# EAGLE design switch_v0.1 (EAGLE 7.7.0)

## Sheet 1 of 2
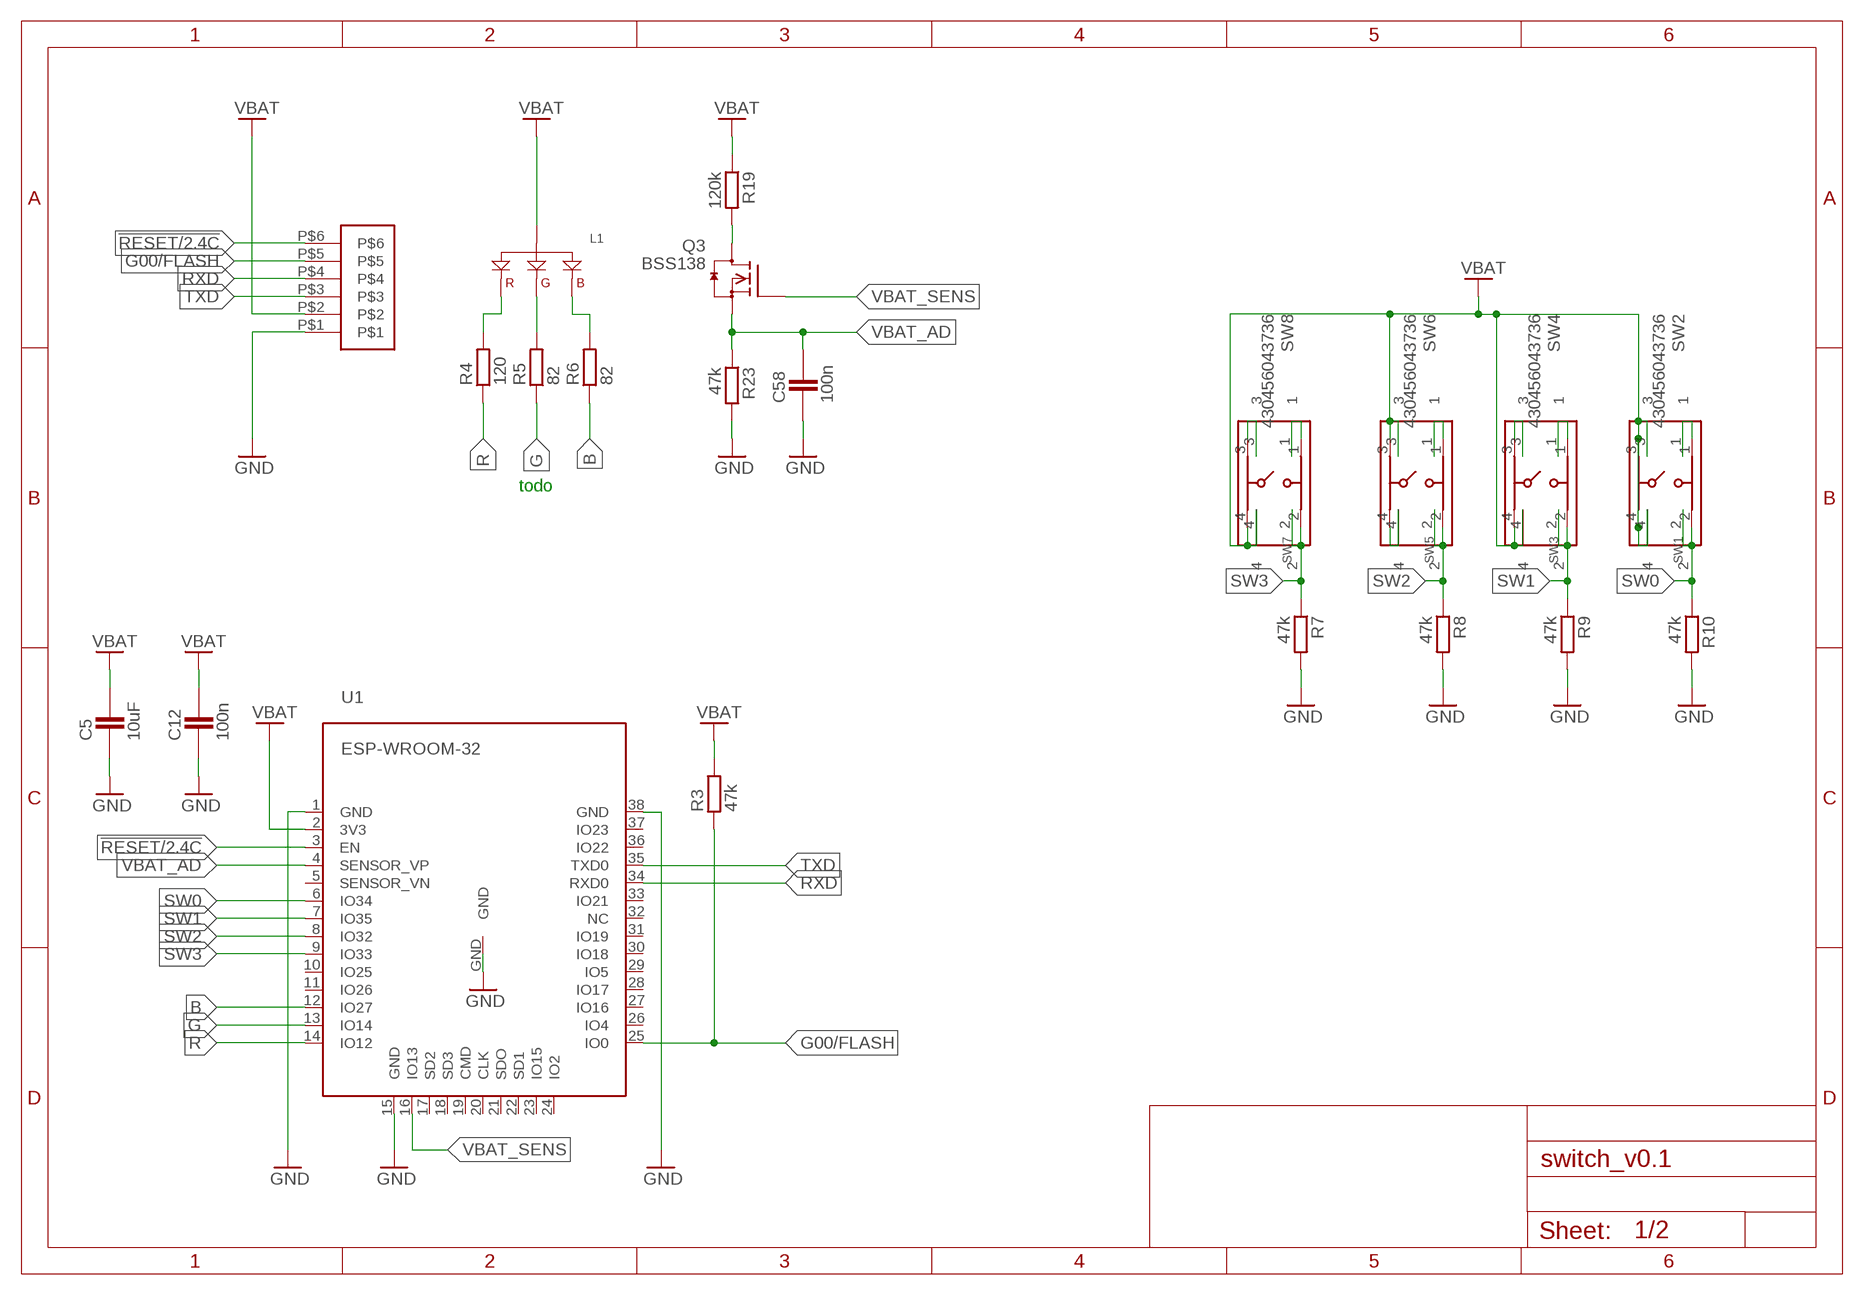
[diagram p0: schematic, sheet 1]

### Parts
C5  10uF  CAPACITOR_0805  [CAPC2012X145AN]
C12  100n  CAPACITOR_0402  [CAPC1005X60N]
C58  100n  CAPACITOR_0402  [CAPC1005X60N]
L1  RGBLED_COMMONA  [LEDRGB]
Q3  BSS138  [SOT23]
R3  47k  RESISTOR_0402  [RESC1005X40AN]
R4  120  RESISTOR_0805  [RESC2012X70N]
R5  82  RESISTOR_0805  [RESC2012X70N]
R6  82  RESISTOR_0805  [RESC2012X70N]
R7  47k  RESISTOR_0402  [RESC1005X40AN]
R8  47k  RESISTOR_0402  [RESC1005X40AN]
R9  47k  RESISTOR_0402  [RESC1005X40AN]
R10  47k  RESISTOR_0402  [RESC1005X40AN]
R19  120k  RESISTOR_0402  [RESC1005X40AN]
R23  47k  RESISTOR_0402  [RESC1005X40AN]
SW1  4301X20858X6  [4301X20858X6]
SW2  430456043736  [430456043736]
SW3  4301X20858X6  [4301X20858X6]
SW4  430456043736  [430456043736]
SW5  4301X20858X6  [4301X20858X6]
SW6  430456043736  [430456043736]
SW7  4301X20858X6  [4301X20858X6]
SW8  430456043736  [430456043736]
U1  ESP-WROOM-32  [ESP-WROOM-32]
U$3  3X2-2.00RM  [3X2-2.00RM]

### Nets
!RESET: U1.3(EN) U$3.P$6 ; also sheet 2
B: R6.1 U1.12(IO27)
G: R5.1 U1.13(IO14)
G00/FLASH: R3.1 U1.25(IO0) U$3.P$5
GND: C5.1 C12.1 C58.1 R7.2 R8.2 R9.2 R10.2 R23.2 U1.1(GND) U1.15(GND) U1.38(GND) U1.GND U$3.P$1 ; also sheet 2
N$4: L1.1(R) R4.2
N$5: L1.3(G) R5.2
N$6: L1.4(B) R6.2
N$7: SW5.1 SW6.1
N$8: SW5.4 SW6.4
N$9: SW7.3 SW8.3
N$11: SW7.1 SW8.1
N$12: SW3.1 SW4.1
N$13: SW3.3 SW4.3
N$14: SW1.1 SW2.1
N$51: Q3.3(D) R19.2
R: R4.1 U1.14(IO12)
RXD: U1.34(RXD0) U$3.P$4
SW0: R10.1 SW1.2 SW2.2 U1.6(IO34)
SW1: R9.1 SW3.2 SW4.2 U1.7(IO35)
SW2: R8.1 SW5.2 SW6.2 U1.8(IO32)
SW3: R7.1 SW7.2 SW8.2 U1.9(IO33)
TXD: U1.35(TXD0) U$3.P$3
VBAT: C5.2 C12.2 L1.2(A) R3.2 R19.1 SW1.3 SW1.4 SW2.3 SW2.4 SW3.4 SW4.4 SW5.3 SW6.3 SW7.4 SW8.4 U1.2(3V3) U$3.P$2 ; also sheet 2
VBAT_AD: C58.2 Q3.2(S) R23.1 U1.4(SENSOR_VP)
VBAT_SENS: Q3.1(G) U1.16(IO13)
Unconnected: U1.5(SENSOR_VN) U1.10(IO25) U1.11(IO26) U1.17(SD2) U1.18(SD3) U1.19(CMD) U1.20(CLK) U1.21(SDO) U1.22(SD1) U1.23(IO15) U1.24(IO2) U1.26(IO4) U1.27(IO16) U1.28(IO17) U1.29(IO5) U1.30(IO18) U1.31(IO19) U1.32(NC) U1.33(IO21) U1.36(IO22) U1.37(IO23)

### Notes on the sheet
- todo

## Sheet 2 of 2
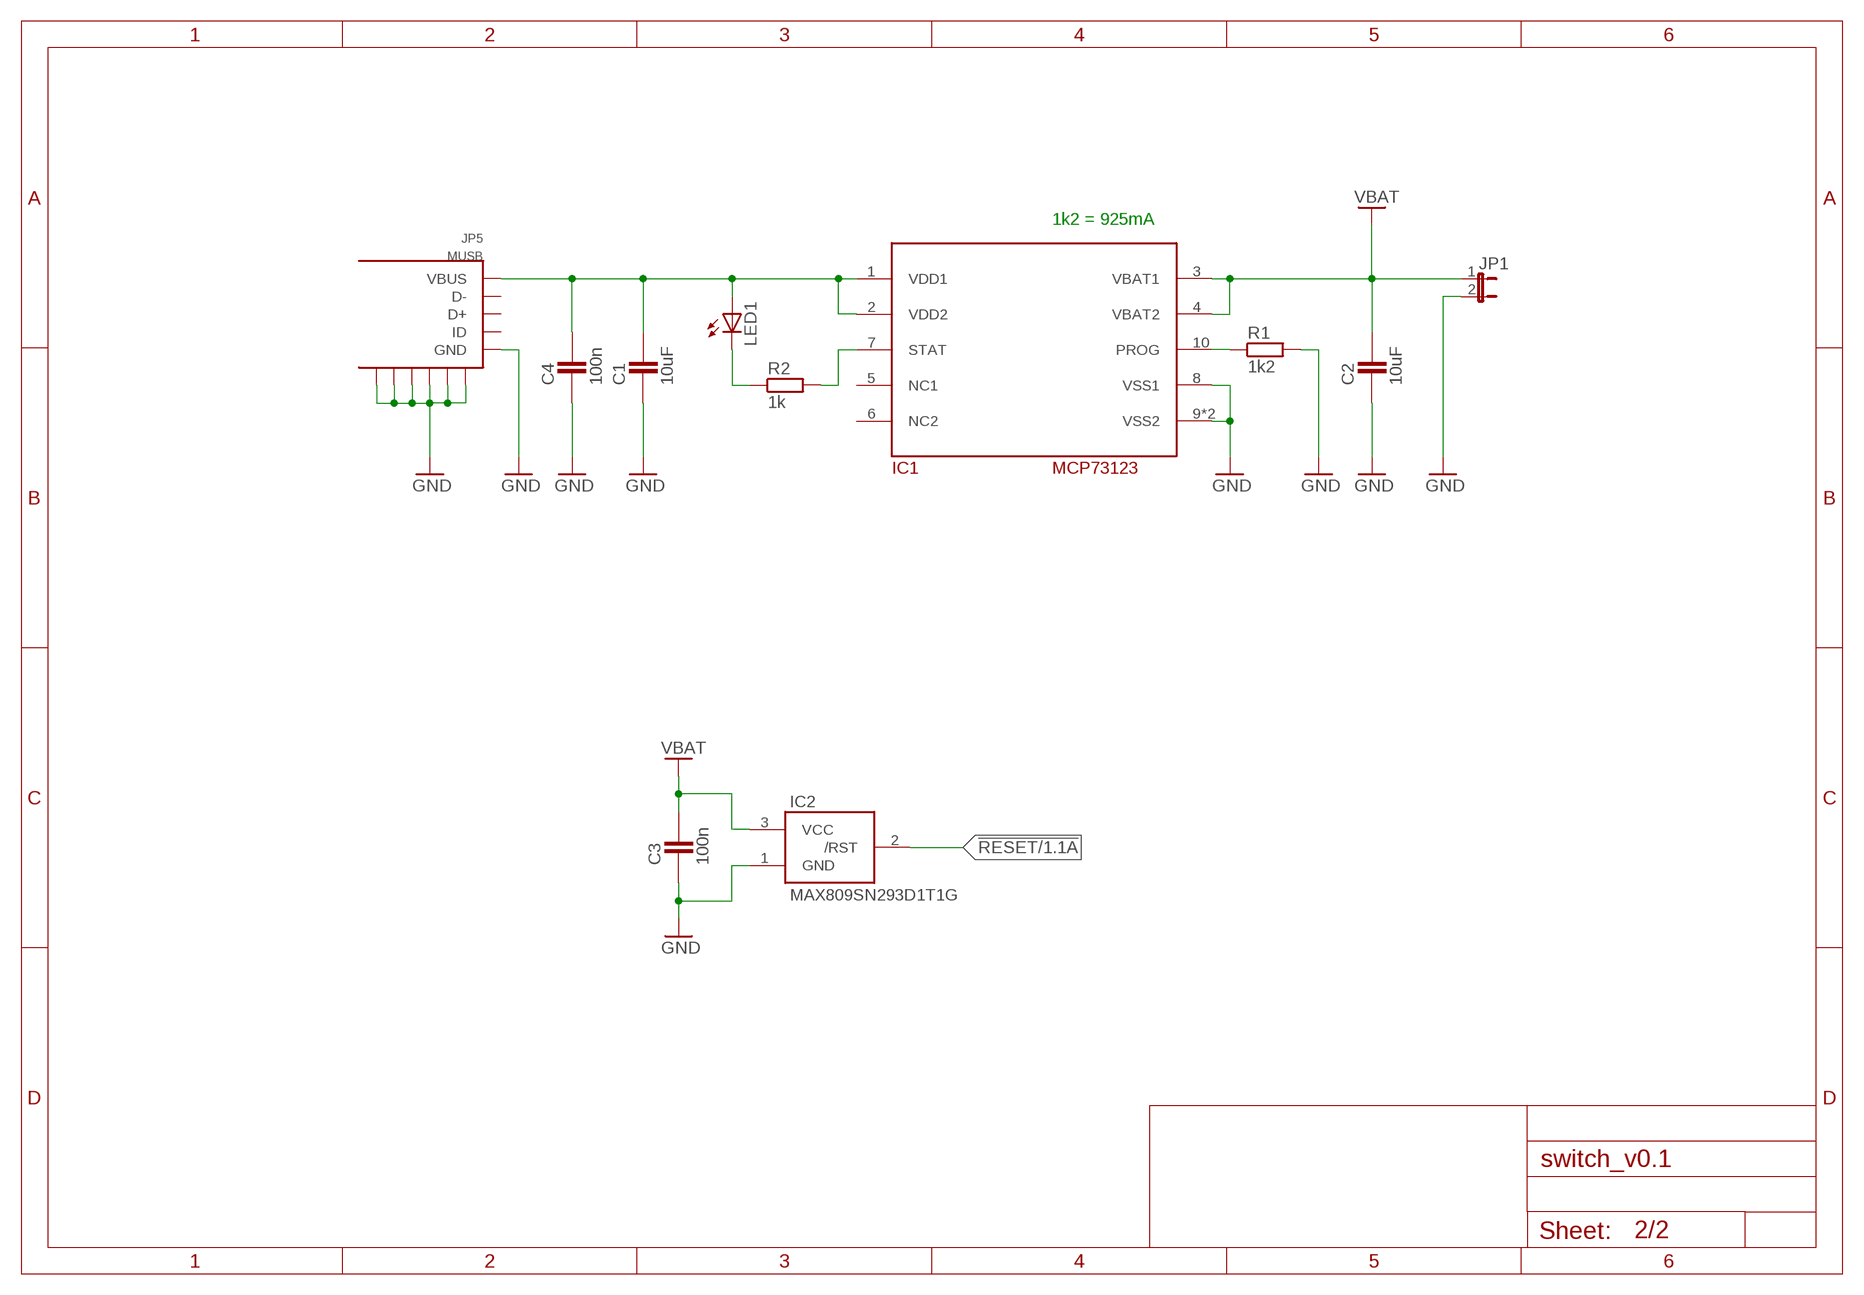
[diagram p1: schematic, sheet 2]

### Parts
C1  10uF  CAPACITOR_0805  [CAPC2012X145AN]
C2  10uF  CAPACITOR_0805  [CAPC2012X145AN]
C3  100n  CAPACITOR_0402  [CAPC1005X60N]
C4  100n  CAPACITOR_0402  [CAPC1005X60N]
IC1  MCP73123  [DFN10-3X3]
IC2  MAX809SN293D1T1G  MAX809JEUR  [SOT23]
JP1  JP1E  [JP1]
JP5  MUSB  [MICRO-USB]
LED1  LEDCHIPLED_0805  [CHIPLED_0805]
R1  1k2  RESISTOR_0402  [RESC1005X40AN]
R2  1k  RESISTOR_0402  [RESC1005X40AN]

### Nets
!RESET: IC2.2(/RST) ; also sheet 1
GND: C1.1 C2.1 C3.1 C4.1 IC1.8(VSS1) IC1.9(VSS2) IC1.EXP(VSS2) IC2.1(GND) JP1.2 JP5.G$1(S1) JP5.G$2(S2) JP5.G$3(S3) JP5.G$4(S4) JP5.P$5(GND) JP5.S$1(S5) JP5.S$2(S6) R1.2 ; also sheet 1
N$1: C1.2 C4.2 IC1.1(VDD1) IC1.2(VDD2) JP5.P$1(VBUS) LED1.A
N$2: LED1.C R2.1
N$3: IC1.7(STAT) R2.2
N$10: IC1.10(PROG) R1.1
VBAT: C2.2 C3.2 IC1.3(VBAT1) IC1.4(VBAT2) IC2.3(VCC) JP1.1 ; also sheet 1
Unconnected: IC1.5(NC1) IC1.6(NC2) JP5.P$2(D-) JP5.P$3(D+) JP5.P$4(ID)

### Notes on the sheet
- 1k2 = 925mA

## Library data of the parts
C1-C5 C12 C58 = ipc-7351-capacitor:CAPACITOR_
IC1 = LiFePO4wer:MCP73123: MCP73123 LiFePO4 battery charger
IC2 = maxim-10:MAX809*: 3-Pin Microprocessor Reset Circuit
JP1 = jumper:JP1E: JUMPER
JP5 = vario_spc:MUSB
L1 = sid:RGBLED_COMMONA
LED1 = led:LED: LED OSRAM: - CHIPLED LG R971, LG N971, LY N971, LG Q971, LY Q971, LO R971, LY R971 LH N974, LH R974 LS Q976, LO Q976, LY Q976 LO Q996 - Hyper CHIPLED LW Q18S LB Q993, LB Q99A, LB R99A - SideLED LS A670, LO A670, LY A670, LG A670, LP A670 LB A673, LV A673, LT A673, LW A673 LH A674 LY A675 LS A676, LA A676, LO A676, LY A676, LW A676 LS A679, LY A679, LG A679 - Hyper Micro SIDELED® LS Y876, LA Y876, LO Y876, LY Y876 LT Y87S - SmartLED LW L88C, LW L88S LB L89C, LB L89S, LG L890 LS L89K, LO L89K, LY L89K LS L896, LA L896, LO L896, LY L896 - TOPLED LS T670, LO T670, LY T670, LG T670, LP T670 LSG T670, LSP T670, LSY T670, LOP T670, LYG T670 LG T671, LOG T671, LSG T671 LB T673, LV T673, LT T673, LW T673 LH T674 LS T676, LA T676, LO T676, LY T676, LB T676, LH T676, LSB T676, LW T676 LB T67C, LV T67C, LT T67C, LS T67K, LO T67K, LY T67K, LW E67C LS E67B, LA E67B, LO E67B, LY E67B, LB E67C, LV E67C, LT E67C LW T67C LS T679, LY T679, LG T679 LS T770, LO T770, LY T770, LG T770, LP T770 LB T773, LV T773, LT T773, LW T773 LH T774 LS E675, LA E675, LY E675, LS T675 LS T776, LA T776, LO T776, LY T776, LB T776 LHGB T686 LT T68C, LB T68C - Hyper Mini TOPLED® LB M676 - Mini TOPLED Santana® LG M470 LS M47K, LO M47K, LY M47K Source: http://www.osram.convergy.de LUXEON: - LUMILED® LXK2-PW12-R00, LXK2-PW12-S00, LXK2-PW14-U00, LXK2-PW14-V00 LXK2-PM12-R00, LXK2-PM12-S00, LXK2-PM14-U00 LXK2-PE12-Q00, LXK2-PE12-R00, LXK2-PE12-S00, LXK2-PE14-T00, LXK2-PE14-U00 LXK2-PB12-K00, LXK2-PB12-L00, LXK2-PB12-M00, LXK2-PB14-N00, LXK2-PB14-P00, LXK2-PB14-Q00 LXK2-PR12-L00, LXK2-PR12-M00, LXK2-PR14-Q00, LXK2-PR14-R00 LXK2-PD12-Q00, LXK2-PD12-R00, LXK2-PD12-S00 LXK2-PH12-R00, LXK2-PH12-S00 LXK2-PL12-P00, LXK2-PL12-Q00, LXK2-PL12-R00 Source: www.luxeon.com KINGBRIGHT: KA-3528ASYC Source: www.kingbright.com
Q3 = m-pad-2.1-mod:BSS138: Fairchild Semiconductors BSS138 N-Channel Logic Level Enhancement Mode Field Effect Transistor General Description: These N-Channel enhancement mode field effect transistors are produced using Fairchild's proprietary, high cell density, DMOS technology. These products have been designed to minimize on-state resistance while provide rugged, reliable, and fast switching performance.These products are particularly suited for low voltage, low current applications such as small servo motor control, power MOSFET gate drivers, and other switching applications. Features: 0.22 A, 50 V. RDS(ON) = 3.5Ohm @ VGS = 10 V RDS(ON) = 6.0Ohm @ VGS = 4.5 V High density cell design for extremely low RDS(ON) Rugged and Reliable Compact industry standard SOT-23 surface mount package Please send any comments to: messi@users.sourceforge.net
R1-R10 R19 R23 = ipc-7351-resistor:RESISTOR_
SW1 SW3 SW5 SW7 = EAGLE-TACT_SWITCHES-rev1:4301X20858X6: WS-TASV Tact Switch, SMD version Specification Contact Rating Switching :50mA, 12VDC Contact Resistance Initial: 100mΩ max. After life test: 2mΩ max. Insulation Resistance: min.100MΩ at 500VDC Dielectric Strength : 250VAC for 1 minute Stroke :0.3 ± 0.1mm. Bounce : 10ms max. Material Cover : : Stainless Steel Stem :PA9T UL 94 V-0. Frame :PA9T UL 94 V-0, color Black Contact : :Stainless Steel with Silver Terminal : Copper Alloy with Silver <http://katalog.we-online.de/media/images/v2/Family_WS-TASV-Gruppe.jpg> Details see: http://katalog.we-online.de/en/em/TASV_12X12_SMD 2015 (C) Wurth Elektronik
SW2 SW4 SW6 SW8 = EAGLE-TACT_SWITCHES-rev1:430456043736: WS-TSW, 12*12mm horizontal type washable Tact switch, ,THT, 4 pins, height 4.3mm, round salmon actuator, 360gf
U1 = esp32:ESP-WROOM-32
U$3 = falkor:3X2-2.00RM

## Net classes
0 default: width 0.15 mm, drill 0.2 mm, clearance 0.15 mm

## Board
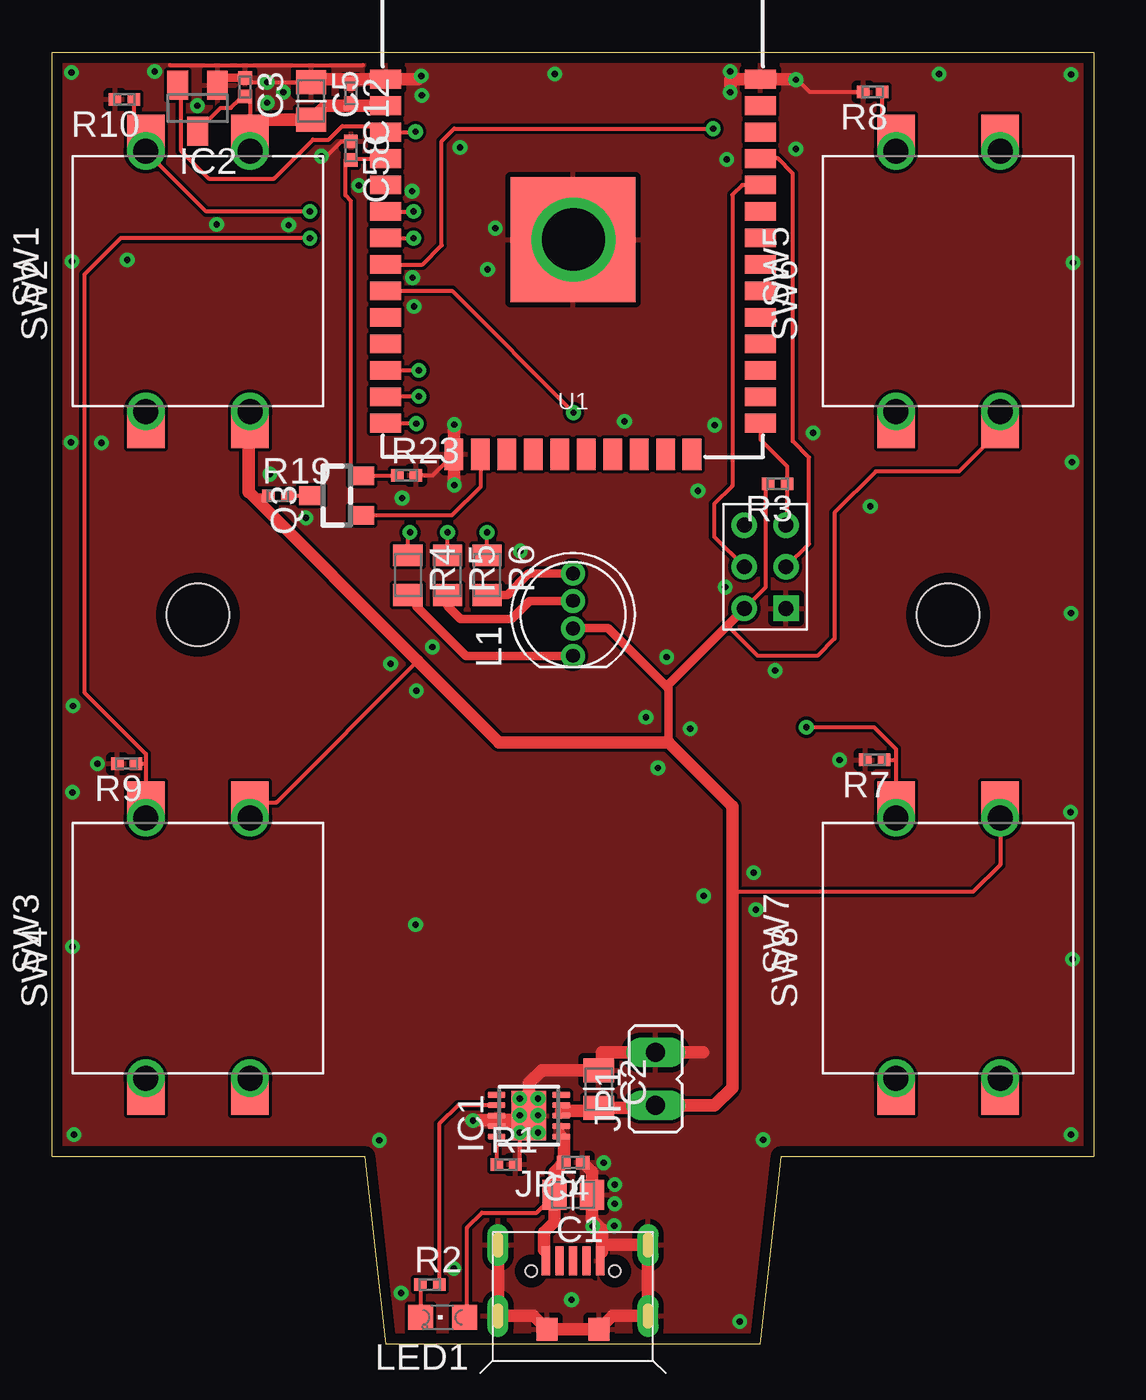
[diagram p2: board, top side]
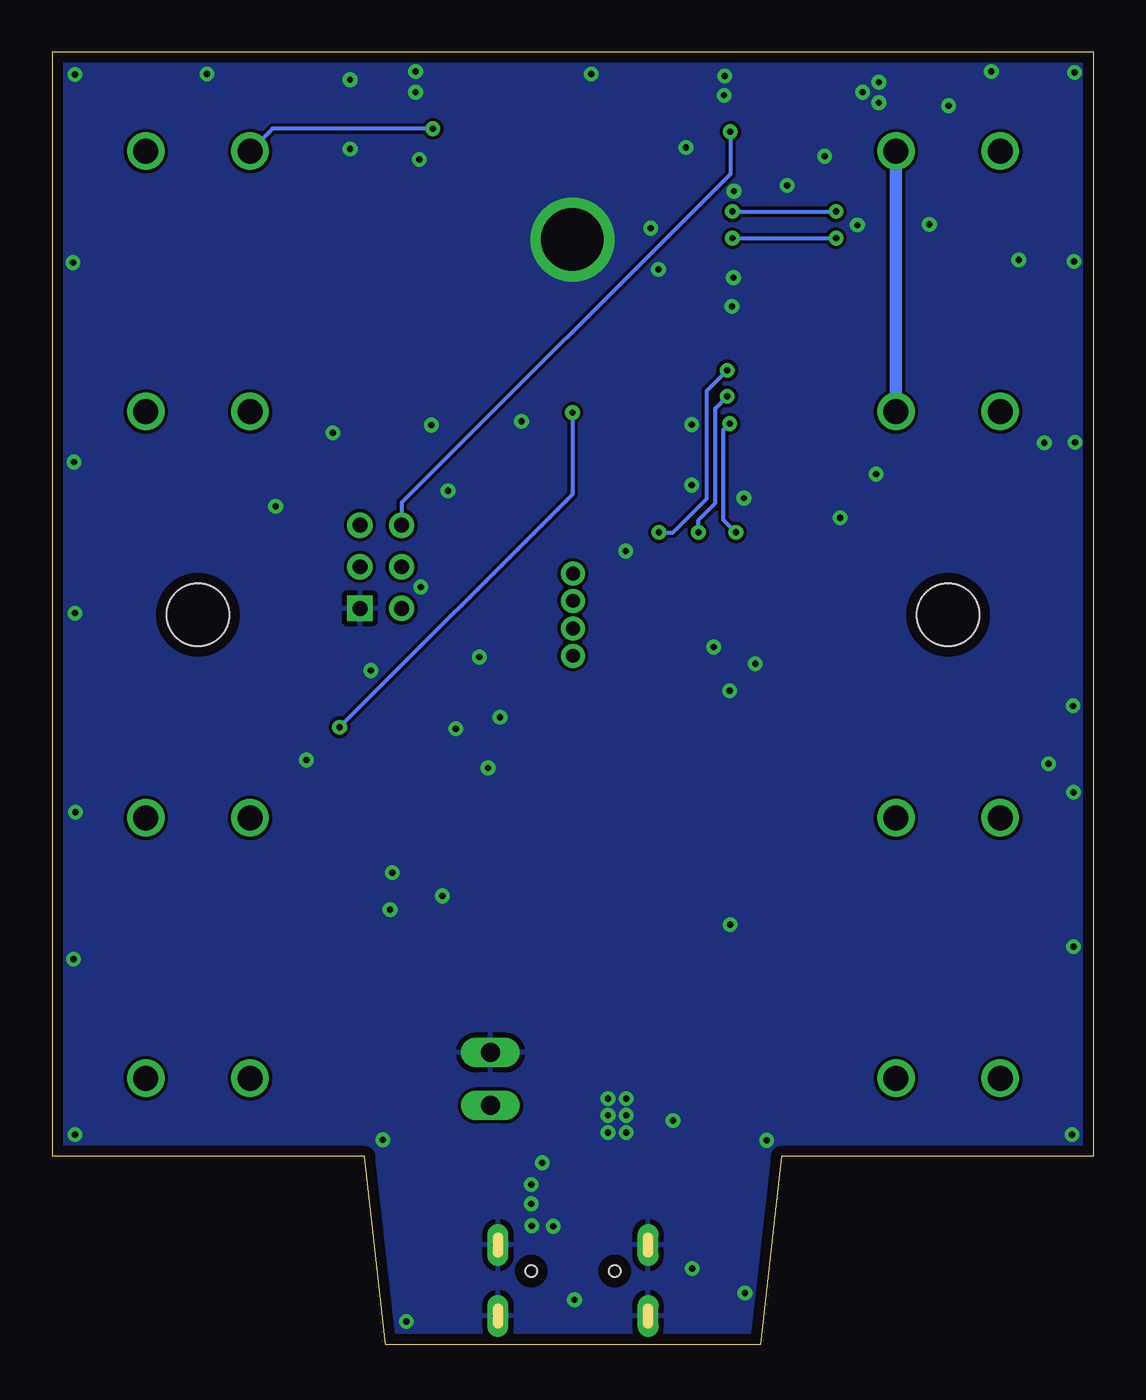
[diagram p3: board, bottom side, seen from below]

Size 50 x 62 mm. Coordinates in mm from the lower left corner, seen from the top.
Outline: 0,9 0,62 50,62 50,9 35,9 34,0 16,0 15,9 0,9
Copper layers (1*16): Top 0.035mm / dielectric 1.5mm / Bottom 0.035mm
Design rules "default *": minimum track width 6mil, minimum drill 0.3mm, track to track 6mil, track to pad 6mil, pad to pad 6mil, via to via 6mil, smd to smd 6mil, copper to edge 20mil, drill to drill 8mil, minimum pad ring 10mil, minimum via ring 8mil, stop-mask expansion 4mil, vias tented up to drill 24mil, thermal gap 10mil
Holes 3 mm at 7,35 43,35

### Footprints (pad centres in the part's own frame; a part is rotated, then mirrored left to right if it is on the bottom)
CAPC2012X145AN = smd 1.15 x 1.45: 1 -0.9,0; 2 0.9,0
CAPC1005X60N = smd 0.65 x 0.65: 1 -0.45,0; 2 0.45,0
DFN10-3X3 = smd 0.3 x 0.85: 1 -1,-1.55; 2 -0.5,-1.55; 3 0,-1.55; 4 0.5,-1.55; 5 1,-1.55; 6 1,1.55; 7 0.5,1.55; 8 0,1.55; 9 -0.5,1.55; 10 -1,1.55 | smd 2.38 x 1.65: EXP 0,0
SOT23 = smd 1 x 1.4: 1 -0.95,-1.1; 2 0.95,-1.1; 3 0,1.1
JP1 = drill 0.914 long: 1 0,-1.27; 2 0,1.27
MICRO-USB = drill 0.5 long: G$1 -3.6,0.75; G$2 3.6,0.75; G$3 3.6,-2.65; G$4 -3.6,-2.65 | smd 0.4 x 1.4: P$1 -1.3,0; P$2 -0.65,0; P$3 0,0; P$4 0.65,0; P$5 1.3,0 | smd 1 x 1.1: S$1 -1.246,-3.292; S$2 1.246,-3.292 | hole 0.55: -2,-0.5; 2,-0.5
LEDRGB = drill 0.65: 1 -1.975,0; 2 -0.663,0; 3 0.663,0; 4 1.975,0
CHIPLED_0805 = smd 1.2 x 1.2: A 0,-1.05; C 0,1.05
SOT23' = smd 0.9 x 1.2: 1 -0.95,-1.2; 2 0.95,-1.2; 3 0,1.2
RESC1005X40AN = smd 0.6 x 0.6: 1 -0.45,0; 2 0.45,0
RESC2012X70N = smd 1.05 x 1.4: 1 -0.95,0; 2 0.95,0
4301X20858X6 = smd 2 x 1.8: 1 -7,2.5; 2 7,2.5; 3 -7,-2.5; 4 7,-2.5
430456043736 = drill 1.2: 1 -6.25,2.5; 2 6.25,2.5; 3 -6.25,-2.5; 4 6.25,-2.5
ESP-WROOM-32 = smd 0.9 x 1.5: 1 7.7,9; 2 6.43,9; 3 5.16,9; 4 3.89,9; 5 2.62,9; 6 1.35,9; 7 0.08,9; 8 -1.19,9; 9 -2.46,9; 10 -3.73,9; 11 -5,9; 12 -6.27,9; 13 -7.54,9; 14 -8.81,9; 25 -8.81,-9; 26 -7.54,-9; 27 -6.27,-9; 28 -5,-9; 29 -3.73,-9; 30 -2.46,-9; 31 -1.19,-9; 32 0.08,-9; 33 1.35,-9; 34 2.62,-9; 35 3.89,-9; 36 5.16,-9; 37 6.43,-9; 38 7.7,-9 | smd 1.5 x 0.9: 15 -10.3,5.715; 16 -10.3,4.445; 17 -10.3,3.175; 18 -10.3,1.905; 19 -10.3,0.635; 20 -10.3,-0.635; 21 -10.3,-1.905; 22 -10.3,-3.175; 23 -10.3,-4.445; 24 -10.3,-5.715 | smd 6 x 6: GND 0,0
3X2-2.00RM = drill 0.711 square: P$1 -2,0 | drill 0.711: P$2 -2,2; P$3 0,0; P$4 0,2; P$5 2,0; P$6 2,2

### Placement (x,y rotation side)
C1  25,7.16 180 top
C2  26.23,12.23 270 top
C3  9.27,60.31 270 top
C4  25.02,8.71 180 top
C5  12.43,59.65 270 top
C12  14.34,60.02 270 top
C58  14.34,57.27 270 top
IC1  22.89,10.96 90 top
IC2  6.99,59.31 180 top
JP1  28.96,12.72 0 top
JP5  25,4 0 top
L1  25,35 90 top
LED1  18.73,1.28 90 top
Q3  BSS138  [SOT23']  13.66,40.72 90 top
R1  21.79,8.62 0 top
R2  18.13,2.87 0 top
R3  34.82,41.28 180 top
R4  17.07,36.9 270 top
R5  18.98,36.9 270 top
R6  20.88,36.9 270 top
R7  39.48,28.04 180 top
R8  39.38,60.09 180 top
R9  3.58,27.86 180 top
R10  3.47,59.73 180 top
R19  10.84,40.72 0 top
R23  17.02,41.69 0 top
SW1  7,51 90 top
SW2  7,51 90 top
SW3  7,19 90 top
SW4  7,19 90 top
SW5  43,51 90 top
SW6  43,51 90 top
SW7  43,19 90 top
SW8  43,19 90 top
U1  25,53 90 top
U$3  35.23,37.3 90 top

### Tracks (layer width: path | path; a pad name or v marks a point on that pad's centre or on a via)
!RESET  (via drill 0.3)
  Top 0.2: IC2.2 6.17,60.27 6.17,57.27 7.53,55.92 10.65,55.92 12.53,57.8 13.28,57.8 13.93,58.45 15.71,58.45 U1.3 17.43,58.16 v17.45,58.17
  Bottom 0.2: v17.45,58.17 17.45,56.15 33.23,40.38 U$3.P$6
B  (via drill 0.3)
  Top 0.2: R6.1 v20.88,38.95 | v17.6,46.73 U1.12
  Bottom 0.2: v20.88,38.95 20.2,38.95 18.57,40.58 18.57,45.75 v17.6,46.73
G  (via drill 0.3)
  Top 0.2: R5.1 v18.98,38.95 | v17.6,45.48 16.02,45.48 U1.13
  Bottom 0.2: v18.98,38.95 18.98,39.55 18.18,40.35 18.18,44.9 v17.6,45.48
G00/FLASH
  Top 0.2: U1.25 34,43.4 35.27,42.12 R3.1 35.27,39.34 U$3.P$5
GND  (via drill 0.3, 3)
  Top 0.2: JP5.P$5 26.4,4.1 26.4,4.42 | C3.1 9.36,60.55 C5.1 | R23.2 18.27,41.69 U1.15 | C58.1 14.32,57.7 13.88,57.7 13.18,57 v12.93,57 | R8.2 36.37,60.09 35.75,60.7 | R1.2 22.45,8.83 v22.45,10.15 22.14,10.46 IC1.9 IC1.8 21.35,10.97 v22.45,10.97 | 5.65,61.38 14.93,61.38
  Top 0.4: C3.1 8.29,60.77 IC2.1
  Top 0.6: 26.4,4.42 26.4,4.75 | 26.4,4.75 26.4,5.5 25.91,6 C1.1 25.91,8.27 C4.1 | 26.4,4.75 JP5.G$2 JP5.G$3 26.89,1.35 JP5.S$2 JP5.S$1 23.11,1.35 JP5.G$4 JP5.G$1 | IC1.EXP 22.9,10.97 22.9,12.53 23.51,13.13 C2.1 26.38,12.99 26.38,14 27,14 JP1.2 31.22,13.99 31.23,14 | 14.47,60.7 U1.1 17.57,60.7 v17.73,60.85 | 14.47,60.7 12.57,60.7 C5.1 | C12.1 14.34,60.56 14.47,60.7 | v32.55,60.08 32.55,60.7 U1.38 35.75,60.7 | v19.3,44.12 U1.15 19.29,41.23 v19.3,41.23 | 20.1,10.72 22.45,10.72
  other vias: 22.45,11.78 23.32,11.78 23.32,10.97 23.32,10.15 26.48,8.7 27,7.65 27,6.72 25.95,5.65 26.98,5.67 6.97,59.42 17.75,59.92 32.55,61.08 25.02,53 10.32,59.58 10.32,60.55 11.1,60.08 2.17,27.85 37.8,28.02 20.2,10.72 16.8,40.6 14.72,55.6 17.27,55.33 17.3,51.17 20.9,51.58 21.27,53.55 11.35,53.7 7.9,53.73 19.57,57.42 32.38,56.85 35.7,57.35 35.7,60.67 32.3,36.33 29.5,32.98 28.5,30.07 30.62,29.52 29.07,27.65 34.7,32.33 1,30.62 0.95,51.95 0.9,43.27 2.38,43.25 0.93,61.02 4.92,61.08 24.12,60.95 42.58,60.95 48.9,60.92 49,51.9 48.95,42.33 48.9,35.08 48.88,25.52 48.98,18.48 48.9,10.05 34.12,9.8 33.77,20.85 31.27,21.5 33.67,22.62 33,1.07 24.93,2.12 19.27,3.62 16.75,2.45 15.7,9.78 1.05,10.05 0.98,19.07 0.98,26.48 17.45,20.12 16.25,32.65 17.48,31.35 18.25,33.45 10.45,41.75 12.18,39.65 3.6,52.02 27.48,44.27 31,40.95 31.8,44.1 36.52,43.73 39.27,40.2 22.48,38.05 17.38,49.8
  pour Top (rank 2): 0.5,61.5 0.5,0.5 49.5,0.5 49.5,61.5
  pour Bottom: 0.5,61.5 0.5,0.5 49.5,0.5 49.5,61.5
N$1
  Top 0.2: JP5.P$1 23.6,4 23.6,4.53 | LED1.A 19.93,1.3 19.93,5.6 20.62,6.3 23.25,6.3 C1.2
  Top 0.3: IC1.2 IC1.1
  Top 0.6: 23.6,4.53 23.6,5.35 24.11,5.86 C1.2 24.11,8.25 C4.2 24.57,9.83 IC1.1
  pour Top (no thermals): 24.12,10.5 24.12,9.93 24.75,9.93 24.75,10.5
N$2
  Top 0.2: R2.1 LED1.C
N$3
  Top 0.2: IC1.7 19.48,11.46 18.58,10.55 R2.2
N$4
  Top 0.4: L1.1 19.88,33.02 17.48,35.42 17.48,35.55 R4.2
N$5
  Top 0.4: L1.3 22.91,35.66 22.05,34.8 19.6,34.8 18.98,35.42 R5.2
N$6
  Top 0.4: L1.4 22.88,36.98 21.85,35.95 R6.2
N$7
  Top 0.2: SW6.1 SW5.1
N$8
  Top 0.2: SW5.4 SW6.4
N$9
  Top 0.2: SW8.3 SW7.3
N$10
  Top 0.2: IC1.10 R1.1
N$11
  Top 0.2: SW8.1 SW7.1
N$12
  Top 0.2: SW4.1 SW3.1
N$13
  Top 0.2: SW4.3 SW3.3
N$14
  Top 0.2: SW2.1 SW1.1
N$51
  Top 0.2: R19.2 Q3.3
R  (via drill 0.3)
  Top 0.2: R4.1 17.07,38.85 v17.18,38.95 | v17.48,44.17 16.02,44.17 U1.14
  Bottom 0.2: v17.18,38.95 17.77,39.55 17.77,43.88 v17.48,44.17
RXD
  Top 0.2: U1.34 33.12,55.62 32.65,55.15 32.65,41.17 31.77,40.3 31.77,38.75 U$3.P$4
SW0  (via drill 0.3)
  Top 0.2: R10.1 3.92,58.58 SW1.2 SW2.2 7.4,54.35 v12.38,54.35 | U1.6 v17.35,54.35
  Bottom 0.2: v17.35,54.35 v12.38,54.35
SW1  (via drill 0.3)
  Top 0.2: U1.7 v17.34,53.08 v17.35,53.08 | v12.38,53.08 3.3,53.08 1.55,51.33 1.55,31.27 4.5,28.32 4.5,27.82 | 4.5,27.82 SW3.2 SW4.2 | R9.1 4.46,27.86 4.5,27.82
  Bottom 0.2: v17.35,53.08 v12.38,53.08
SW2  (via drill 0.3)
  Top 0.2: U1.8 17.79,51.81 18.7,52.73 18.7,57.73 19.3,58.33 v31.73,58.33 | R8.1 39.83,58.67 | 39.83,58.67 SW5.2 | 39.83,58.67 39.83,57.92 SW6.2
  Bottom 0.2: v31.73,58.33 39.42,58.33 SW6.2
SW3  (via drill 0.3)
  Top 0.2: U1.9 19.18,50.54 v25.02,44.7 | v36.2,29.6 39.45,29.6 40.5,28.55 40.5,28.1 | 40.5,28.1 SW7.2 SW8.2 | R7.1 40.44,28.04 40.5,28.1
  Bottom 0.2: v25.02,44.7 25.02,40.77 v36.2,29.6
TXD
  Top 0.2: U$3.P$3 36.33,38.4 36.33,42.55 35.55,43.33 35.55,56.17 34.83,56.9 U1.35
VBAT
  Top 0.2: 10.25,58.75 9.97,58.48 | 9.97,58.48 SW1.4 SW2.4 | 9.97,58.48 9.97,58.5 9.5,58.98 9.5,59.66 C3.2 8.99,59.74 8.57,59.33 8.1,59.33 IC2.3 | R19.1 9.59,40.72 9.43,40.88 | 17.55,32.77 10.78,26 SW3.4 SW4.4 | 32.65,21.7 44.2,21.7 45.5,23 SW8.4 SW7.4 | R3.2 34.23,41.14 34.23,36.3 U$3.P$2 | 32.41,34.49 33.88,33.02 36.73,33.02 37.55,33.85 37.55,39.9 39.52,41.88 43.52,41.88 45.5,43.85 SW5.3 SW6.3 | SW1.3 SW2.3
  Top 0.3: 24.43,11.2 IC1.4 IC1.3
  Top 0.4: 29.57,28.88 29.57,31.45 | 29.57,31.45 26.68,34.35 25.01,34.35 L1.2 | 29.57,31.45 29.57,31.65 32.41,34.49 U$3.P$2
  Top 0.6: 24.43,11.2 26.1,11.2 C2.2 28.08,11.34 JP1.1 31.8,11.45 32.65,12.3 32.65,21.7 32.65,25.8 29.57,28.88 21.45,28.88 17.55,32.77 9.43,40.9 | U1.2 14.3,59.43 | 14.3,59.43 13.11,59.43 C5.2 10.25,58.75 | C12.2 14.34,59.47 14.3,59.43 | 9.43,40.88 9.43,40.9 | 9.43,40.9 9.43,44.67 SW2.3
  Bottom 0.6: SW2.3 SW2.4
VBAT_AD
  Top 0.2: R23.1 16.55,41.67 Q3.2 14.37,41.87 14.35,42.02 14.35,54.85 14.07,55.12 14.07,56.81 C58.2 14.41,56.89 U1.4
VBAT_SENS
  Top 0.2: Q3.1 19.2,39.77 20.57,41.15 20.57,42.68 U1.16